# Altium schematic sheet 海关全向控制器主控板电路V3_HC-05.SchDoc
size A4
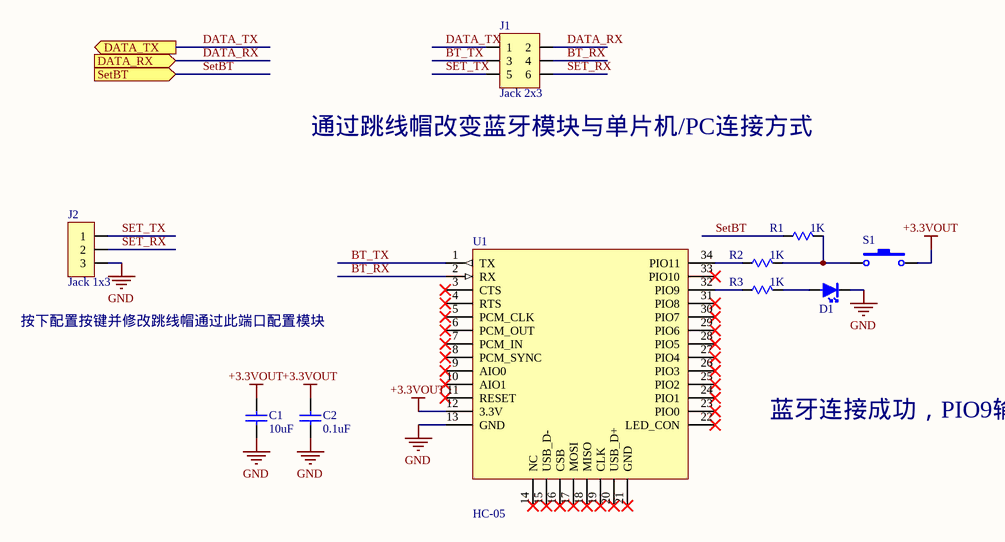
[diagram p0: 海关全向控制器主控板电路V3_HC-05.SchDoc]

## Parts
C1  10uF  [C0805]
C2  0.1uF  [C0805]
D1  LED  [LED0603]  (value not drawn)
J1  Jack 2x3  [Jk2*3-2.0]
J2  Jack 1x3  [Jk1*3-2.0]
R1  1K  [R0805]
R2  1K  [R0805]
R3  1K  [R0805]
S1  SW-PB  [Jk1*2-2.0]  (value not drawn)
U1  HC-05  [HC-05]

## Ports
DATA_RX (in), DATA_TX (out), SetBT (in)

## Nets
+3.3VOUT: C1.1 C2.2 S1.2 U1.12(3.3V)
GND: C1.2 C2.1 D1.2(K) J2.3 U1.13(GND)
BT_RX: J1.4 U1.2(RX)
BT_TX: J1.3 U1.1(TX)
DATA_RX: J1.2 ; port DATA_RX
DATA_TX: J1.1 ; port DATA_TX
SET_RX: J1.6 J2.2
SET_TX: J1.5 J2.1
SetBT: R1.2 ; port SetBT
NetD1_1: D1.1(A) R3.1
NetR1_1: R1.1 R2.1 S1.1
NetR2_2: R2.2 U1.34(PIO11)
NetR3_2: R3.2 U1.32(PIO9)

Not connected (* = marked no-connect by the designer): U1 3(CTS)* 4(RTS)* 5(PCM_CLK)* 6(PCM_OUT)* 7(PCM_IN)* 8(PCM_SYNC)* 9(AIO0)* 10(AIO1)* 11(RESET)* 14(NC)* 15(USB_D-)* 16(CSB)* 17(MOSI)* 18(MISO)* 19(CLK)* 20(USB_D+)* 21(GND)* 22(LED_CON)* 23(PIO0)* 24(PIO1)* 25(PIO2)* 26(PIO3)* 27(PIO4)* 28(PIO5)* 29(PIO6)* 30(PIO7)* 31(PIO8)* 33(PIO10)*

## Notes on the sheet
- (near J1) 通过跳线帽改变蓝牙模块与单片机/PC连接方式
- (near J2) 按下配置按键并修改跳线帽通过此端口配置模块
- 蓝牙连接成功，PIO9输出高电平

## Library data of the parts
C1 = CAP: Published: 8-Jun-2000; LatestRevisionDate: 17-Jul-2002; LatestRevisionNote: Re-released for DXP Platform.; PackageReference: RAD-0.3; Publisher: Altium Limited; Value: 10uF
C2 = Cap Semi
J1 = Jack 2x3: 双排座
J2 = Jack 1x3: 插座
R1-R3 = Res: Resistor; Published: 8-Jun-2000; LatestRevisionDate: 04-Mar-2005; LatestRevisionNote: PCB Footprint replaced.; PackageReference: J1-0603; Publisher: Altium Limited
S1 = SW-PB: Switch; Published: 24-Mar-1999; LatestRevisionDate: 17-Jul-2002; LatestRevisionNote: Re-released for DXP Platform.; PackageReference: SPST-2; Publisher: Altium Limited; PackageDescription: Switch; 2 Leads